# EAGLE design OSSC_HDMI_Audio_v1.5_A4b (EAGLE 7.6.0)
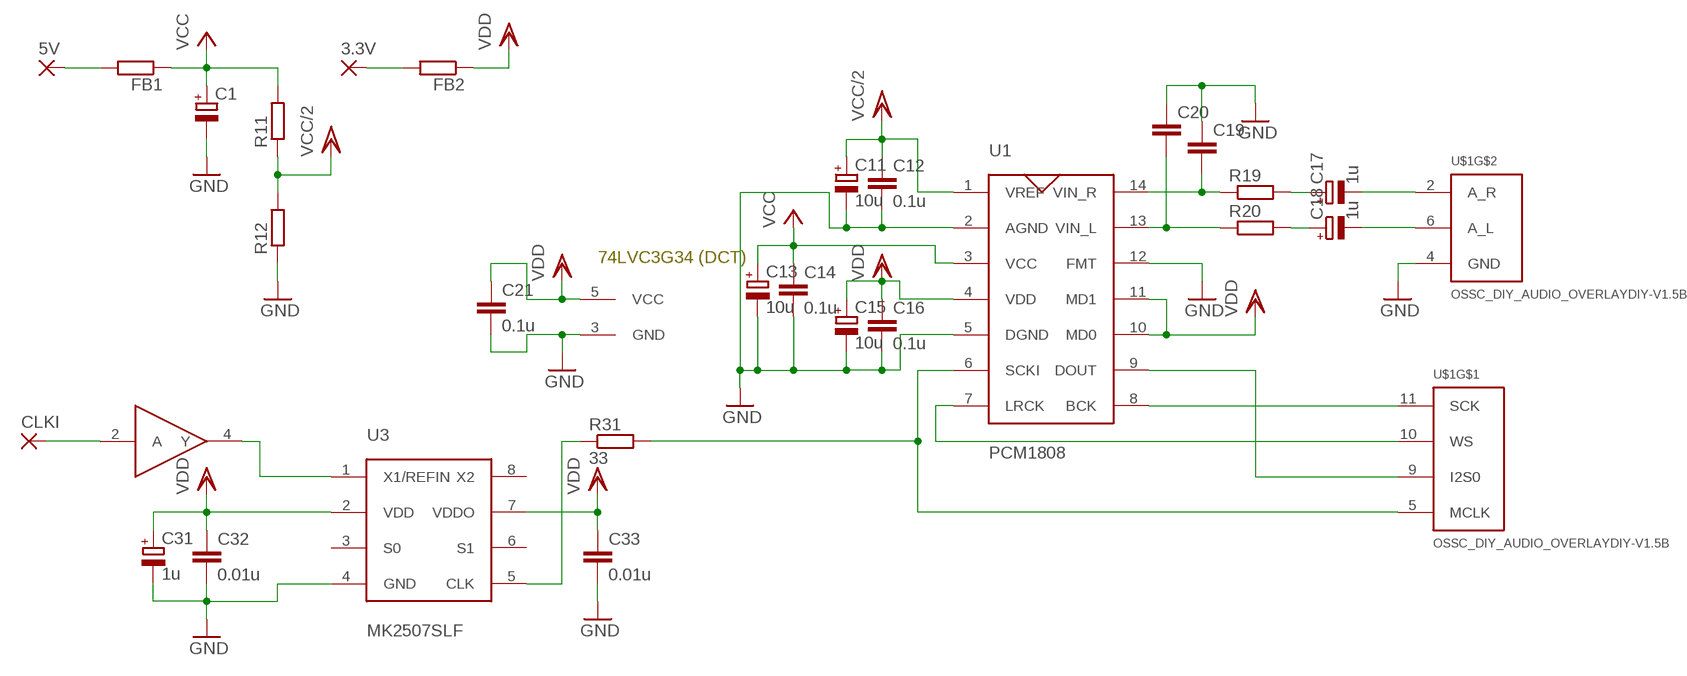
[diagram p0: schematic, sheet 1]

## Parts
3.3V  SMD2  [SMD1,27-2,54]
5V  SMD2  [SMD1,27-2,54]
C1  CPOL-EUSMCC  [SMC_C]
C11  10u  CPOL-EUSMCA  [SMC_A]
C12  0.1u  C-EUC0603  [C0603]
C13  10u  CPOL-EUSMCA  [SMC_A]
C14  0.1u  C-EUC0603  [C0603]
C15  10u  CPOL-EUSMCA  [SMC_A]
C16  0.1u  C-EUC0603  [C0603]
C17  1u  CPOL-EUSMCA  [SMC_A]
C18  1u  CPOL-EUSMCA  [SMC_A]
C19  C-EUC0603  [C0603]
C20  C-EUC0603  [C0603]
C21  0.1u  C-EUC0603  [C0603]
C31  1u  CPOL-EUSMCA  [SMC_A]
C32  0.01u  C-EUC0603  [C0603]
C33  0.01u  C-EUC0603  [C0603]
CLKI  SMD2  [SMD1,27-2,54]
FB1  R-EU_R0603  [R0603]
FB2  R-EU_R0603  [R0603]
R11  R-EU_R0603  [R0603]
R12  R-EU_R0603  [R0603]
R19  R-EU_R0603  [R0603]
R20  R-EU_R0603  [R0603]
R31  33  R-EU_R0603  [R0603]
U1  PCM1808  [PCM1808]
U2  74LVC1G34  [74LVC1G34DCK]
U3  MK2507SLF  [SOIC8]
U$1  OSSC_DIY_AUDIO_OVERLAYDIY-V1.5B  [OSSC_OVERLAY_V1.5B]

## Nets
GND: C1.- C11.- C12.2 C13.- C14.2 C15.- C16.2 C19.1 C20.1 C21.2 C31.- C32.2 C33.2 R12.1 U1.2(AGND) U1.5(DGND) U1.12(FMT) U2.3(GND) U3.4(GND) U$1.4(GND)
N$1: C18.- U$1.6(A_L)
N$2: C17.- U$1.2(A_R)
N$3: C17.+ R19.2
N$4: C19.2 R19.1 U1.14(VIN_R)
N$5: C20.2 R20.1 U1.13(VIN_L)
N$6: C18.+ R20.2
N$7: R31.1 U3.5(CLK)
N$8: U2.4(Y) U3.1(X1/REFIN)
N$9: CLKI.1(P) U2.2(A)
N$10: 5V.1(P) FB1.2
N$11: 3.3V.1(P) FB2.2
N$13: U1.7(LRCK) U$1.10(WS)
N$14: U1.8(BCK) U$1.11(SCK)
N$15: U1.9(DOUT) U$1.9(I2S0)
N$17: R31.2 U1.6(SCKI) U$1.5(MCLK)
VCC: C1.+ C13.+ C14.1 FB1.1 R11.2 U1.3(VCC)
VCC/2: C11.+ C12.1 R11.1 R12.2 U1.1(VREF)
VDD: C15.+ C16.1 C21.1 C31.+ C32.1 C33.1 FB2.1 U1.4(VDD) U1.10(MD0) U1.11(MD1) U2.5(VCC) U3.2(VDD) U3.7(VDDO)
Unconnected: U3.3(S0) U3.6(S1) U3.8(X2)

## Notes on the sheet
- 74LVC3G34 (DCT)

## Library data of the parts
3.3V 5V CLKI = wirepad:SMD2: SMD PAD
C1 C11 C13 C15 C17 C18 C31 = rcl:CPOL-EU: POLARIZED CAPACITOR, European symbol
C12 C14 C16 C19-C21 C32 C33 = rcl:C-EU: CAPACITOR, European symbol
FB1 FB2 R11 R12 R19 R20 R31 = rcl:R-EU_: RESISTOR, European symbol
U1 = OSSC_HDMI_Audio:PCM1808
U2 = OSSC_HDMI_Audio:74LVC1G34
U3 = OSSC_HDMI_Audio:MK2507SLF
U$1 = OSSC_HDMI_Audio:OSSC_DIY_AUDIO_OVERLAY

## Board
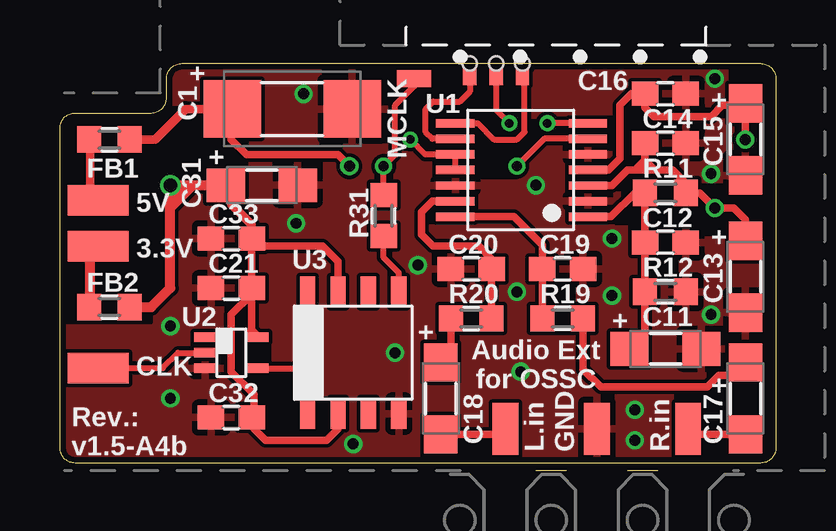
[diagram p1: board, top side]
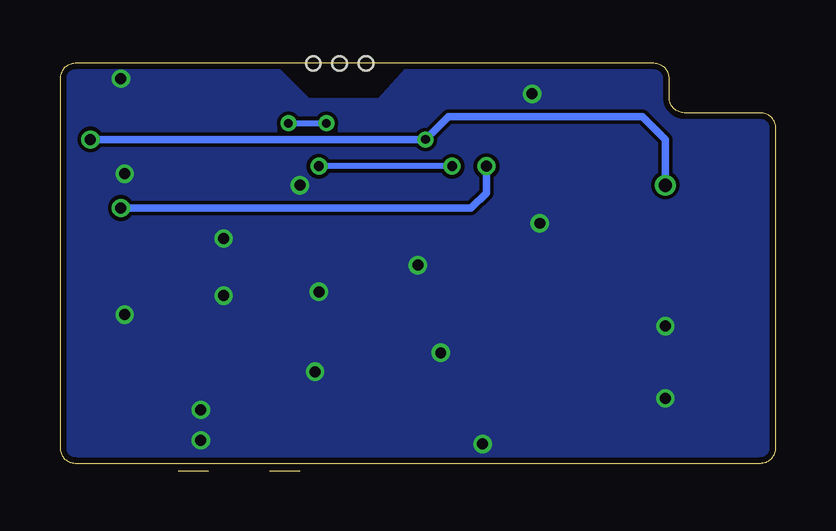
[diagram p2: board, bottom side, seen from below]

Size 29.84 x 16.99 mm. Coordinates in mm from the lower left corner, seen from the top.
Outline: 24.92,0 23.65,0
Outline: 21.11,0 19.84,0
Outline: 0,0.95 0,14.29 arc-90 0.64,14.92 3.81,14.92 arc90 4.45,15.56 4.45,16.35 arc-90 5.08,16.99 29.21,16.99 arc-90 29.84,16.35 29.84,0.95 arc-90 29.21,0.32 0.64,0.32 arc-90 0,0.95
Copper layers (1*16): Top 0.035mm / dielectric 1.5mm / Bottom 0.035mm
Design rules "ITEADstudio_DRC": minimum track width 6mil, minimum drill 12mil, track to track 6mil, track to pad 6mil, pad to pad 6mil, via to via 6mil, smd to smd 0mil, copper to edge 10mil, drill to drill 10mil, minimum pad ring 10mil, minimum via ring 6mil, stop-mask expansion 2mil, vias tented up to drill 30mil, thermal gap 10mil
tRestrict: area 16.8,5.7 to 17.5,7; area 20.6,5.7 to 21.4,7.9; area 23.2,10.3 to 24.3,11; area 24.8,8.1 to 26.5,11; area 1.7,13.2 to 2.4,14.3; area 10.6,1.7 to 11.3,3; area 6.7,8.3 to 7.8,9; area 6.7,10.3 to 7.1,11.1; area 29.4,5.6 to 29.8,17.3; area 26.5,10.6 to 29.8,11.9; area 26.5,9.8 to 27.9,10.6; area 17.1,12.2 to 19.1,13.8; 3 more areas

### Footprints (pad centres in the part's own frame; a part is rotated, then mirrored left to right if it is on the bottom)
SMD1,27-2,54 = smd 1.27 x 2.54: 1 0,0
SMC_C = smd 2.4 x 2.4: + -2.5,0; - 2.5,0
SMC_A = smd 1.6 x 1.4: + -1.5,0; - 1.5,0
C0603 = smd 1.1 x 1: 1 -0.85,0; 2 0.85,0
R0603 = smd 1 x 1.1: 1 -0.85,0; 2 0.85,0
PCM1808 = smd 1.6 x 0.35: 1 -2.8,1.95; 2 -2.8,1.3; 3 -2.8,0.65; 4 -2.8,0; 5 -2.8,-0.65; 6 -2.8,-1.3; 7 -2.8,-1.95; 8 2.725,-1.95; 9 2.725,-1.3; 10 2.725,-0.65; 11 2.725,0; 12 2.725,0.65; 13 2.725,1.3; 14 2.725,1.95
74LVC1G34DCK = smd 0.9 x 0.4: 1 -1.1,0.65; 2 -1.1,0; 3 -1.1,-0.65; 4 1.1,-0.65; 5 1.1,0.65
SOIC8 = smd 1.27 x 0.635: 1 -2.54,1.905; 2 -2.54,0.635; 3 -2.54,-0.635; 4 -2.54,-1.905; 5 2.54,-1.905; 6 2.54,-0.635; 7 2.54,0.635; 8 2.54,1.905
OSSC_OVERLAY_V1.5B = smd 1.067 x 2.184: 2 3.81,8.89; 4 0,8.89; 6 -3.81,8.89 | smd 1.422 x 0.711: 5 -7.62,23.495 | smd 0.55 x 1.05: 9 -5.3,23.75; 10 -4.2,23.75; 11 -3.1,23.75 | hole 0.6: -3.1,24.13; -4.2,24.13; -5.3,24.13

### Placement (x,y rotation side)
3.3V  1.59,9.37 270 top
5V  1.59,11.27 270 top
C1  9.68,15.08 0 top
C11  25.24,5.08 0 top
C12  25.24,9.52 0 top
C13  28.57,8.1 270 top
C14  25.24,13.65 0 top
C15  28.57,13.81 270 top
C16  25.24,15.72 0 top
C17  28.57,3.02 270 top
C18  15.88,3.02 270 top
C19  20.95,8.41 180 top
C20  17.14,8.41 0 top
C21  7.14,7.62 180 top
C31  8.41,11.91 0 top
C32  7.14,9.68 180 top
C33  7.14,2.22 180 top
CLKI  1.59,4.29 270 top
FB1  2.06,13.81 180 top
FB2  2.06,6.83 180 top
R11  25.24,11.59 0 top
R12  25.24,7.46 180 top
R19  20.95,6.35 0 top
R20  17.14,6.35 180 top
R31  13.49,10.64 90 top
U1  19.21,12.54 180 top
U2  7.14,4.92 0 top
U3  12.22,4.92 90 top
U$1  22.38,-7.14 0 top

### Tracks (layer width: path | path; a pad name or v marks a point on that pad's centre or on a via)
GND  (via drill 0.46)
  other vias: 23.02,7.3 23.97,1.27 14.92,8.57 23.02,9.68 4.6,6.03 4.6,3.02 9.84,10.32 19.84,11.91 13.97,4.92 10.16,15.72 27.15,12.38 23.97,2.54 27.15,6.51 27.3,16.35 12.22,1.11 19.21,4.13 19.05,7.46
  pour Top (rank 6): 0,-7.14 30.48,-7.14 30.48,17.14 0,17.14
  pour Bottom (rank 6): 0,0.63 30.48,0.63 30.48,17.14 21.27,17.14 19.53,15.4 16.51,15.4 14.92,17.14 0,17.14
N$1
  Top 0.305: C18.- 18.34,1.52 U$1.6
N$2
  Top 0.305: C17.- 26.42,1.52 U$1.2
N$3
  Top 0.305: C17.+ 28.57,4.13 28.42,3.97 27.46,3.97 26.99,3.49 22.54,3.49 21.8,4.23 R19.2
N$4
  Top 0.305: R19.1 C19.2 20.11,9.42 18.94,10.59 U1.14
N$5
  Top 0.305: U1.13 15.53,11.24 15.08,10.8 15.08,9.84 15.56,9.37 17.46,9.37 18,8.83 C20.2 R20.1
N$6
  Top 0.305: 16.35,6.29 R20.2 16.3,4.94 C18.+ 16.11,4.52 16.19,4.6
N$7
  Top 0.254: U3.5 14.13,8.26 13.49,8.89 R31.1
N$8
  Top 0.254: U2.4 9.86,4.27 10.32,3.81 U3.1
N$9
  Top 0.254: CLKI.1 4.29,4.29 4.92,4.92 U2.2
N$10
  Top 0.356: FB1.2 1.27,13.81 1.27,11.27 5V.1
N$11
  Top 0.406: FB2.2 1.27,6.83 1.27,9.21 1.59,9.21 3.3V.1
N$13  (via drill 0.36)
  Top 0.254: U1.7 v20.32,14.49 | U$1.10 18.18,15.04 v18.73,14.49
  Bottom 0.254: v20.32,14.49 v18.73,14.49
N$14
  Top 0.254: U1.8 17.42,14.49 18.1,13.81 19.05,13.81 19.37,14.13 19.37,16.52 U$1.11
N$15
  Top 0.254: U1.9 15.53,13.84 15.24,14.13 15.24,15.08 15.56,15.4 16.67,15.4 17.08,15.81 U$1.9
N$17  (via drill 0.41)
  Top 0.254: R31.2 v13.49,12.7 13.97,13.18 13.97,15.24 14.76,16.03 U$1.5 | U1.6 20.19,13.84 v19.05,12.7
  Bottom 0.254: v13.49,12.7 v19.05,12.7
VCC  (via drill 0.46)
  Top 0.305: 24.39,12.96 23.97,12.54 | 24.39,12.96 24.81,12.54 | 24.61,12.54 23.97,12.54 | 24.81,12.54 24.61,12.54 | 24.61,12.54 24.45,12.7 | 24.81,12.54 25.56,12.54 26.04,12.07 26.04,11.69 R11.2 | 24.39,12.96 C14.1 | v12.06,12.7 11.59,13.18 7.78,13.18 7.14,13.81 7.14,15.04 C1.+ | R11.2 26.09,11.53 | R11.2 26.67,11.59 v27.3,10.95 28.1,10.95 28.57,10.48 C13.+ | U1.3 23,11.89 23.65,12.54 23.97,12.54
  Top 0.356: FB1.1 3.97,13.81 5.24,15.08 C1.+
  Bottom 0.305: v12.06,12.7 12.06,11.59 12.7,10.95 v27.3,10.95
VCC/2
  Top 0.305: C11.+ 24.39,5.1 R12.2 C12.1 R11.1 23.97,11.59 22.97,10.59 U1.1
VDD  (via drill 0.36, 0.46, 0.56)
  Top 0.254: 28.5,15.24 C15.+ | U1.11 U1.10 15.22,13.19 v14.61,13.81
  Top 0.305: 8.1,2.38 8.1,1.75 8.57,1.27 11.11,1.27 11.59,1.75 U3.2 | 28.5,15.24 27.62,15.24 27.15,14.76 24.77,14.76 24.39,15.14 C16.1 23.81,15.72 23.34,15.24 23.34,13.02 22.86,12.54 U1.4 | U3.7 11.59,8.73 10.95,9.37 8.31,9.37 C32.1 C21.1 | C33.1 8.1,2.38 | 8.1,2.38 8.1,3.18 7.14,4.13 7.14,6.51 7.99,7.36 C21.1 | 7.99,5.82 C21.1 | C15.+ v28.57,13.81
  Top 0.356: 7.99,5.82 U2.5 | C32.1 7.99,10.26 7.14,11.11 7.14,11.68 C31.+
  Top 0.406: FB2.1 3.81,6.83 4.6,7.62 4.6,10.95 | 4.6,11.43 v4.6,11.91 5.08,11.91 | 5.08,11.91 5.56,11.91 | 5.56,11.91 4.6,10.95 | 4.6,10.95 4.6,11.43 | 4.6,11.43 5.08,11.91 | 5.56,11.91 C31.+
  Bottom 0.305: v4.6,11.91 4.6,13.81 5.56,14.76 13.65,14.76 v14.61,13.81 v28.57,13.81

### Text on the board
tPlace: + | + | + | + | + | + | Audio Ext / for OSSC | +
tNames: C16 | C1 | U1 | C14 | MCLK | C15 | FB1 | R11 | 5V | C31 | C33 | R31 | C12 | 3.3V | U3 | C20 | C19 | FB2 | C21 | R12 | R20 | R19 | C13 | U2 | C11 | CLK | C32 | Rev.: / v1.5-A4b | C18 | L.in | GND | R.in | C17